# EAGLE design BEP21 555breakout (EAGLE 6.5.0)
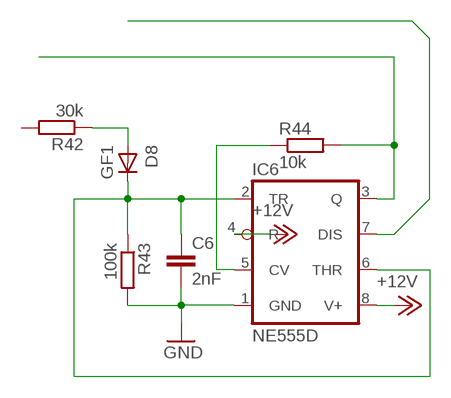
[diagram p0: schematic, sheet 1]

## Parts
C6  2nF  C-EUC1206K  [C1206K]
D8  GF1  [SMA-DO214AC]
IC6  NE555D  [SO08]
R42  30k  R-EU_R0805  [R0805]
R43  100k  R-EU_R0805  [R0805]
R44  10k  R-EU_R0805  [R0805]

## Nets
+12V: IC6.4(R) IC6.8(V+)
GND: C6.2 IC6.1(GND) R43.2
N$1: IC6.7(DIS)
N$84: D8.A R42.1
N$85: IC6.3(Q) R44.2
N$86: IC6.5(CV) R44.1
N$90: C6.1 D8.K(C) IC6.2(TR) IC6.6(THR) R43.1
Unconnected: R42.2

## Library data of the parts
C6 = rcl:C-EU: CAPACITOR, European symbol
D8 = diode:GF1: DIODE
IC6 = linear:*555: TIMER
R42-R44 = rcl:R-EU_: RESISTOR, European symbol

## Board
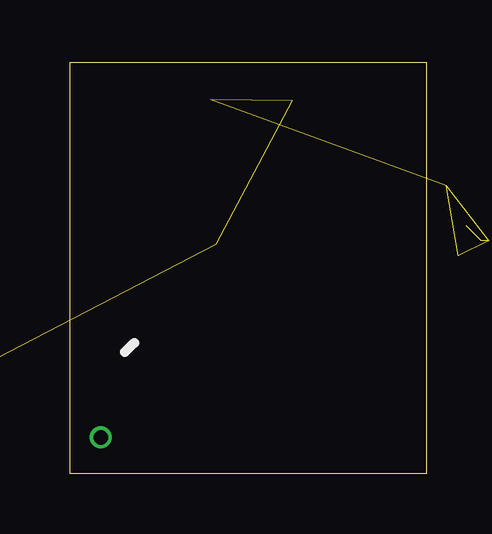
[diagram p1: board, top side]
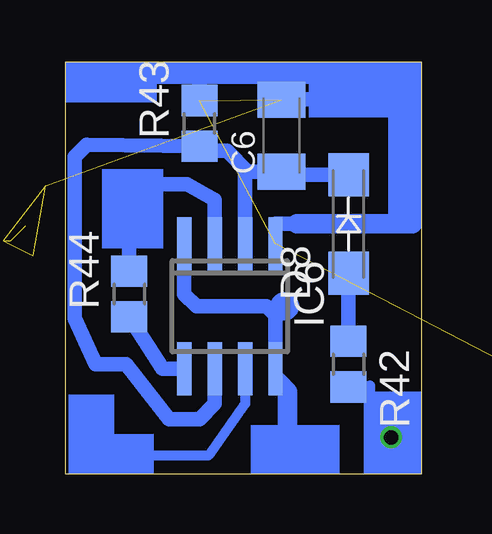
[diagram p2: board, bottom side, seen from below]

Size 14.86 x 17.14 mm. Coordinates in mm from the lower left corner, seen from the top.
Outline: 0,17.14 14.86,17.14 14.86,0 0,0 0,17.14
Copper layers (1*16): Top 0.035mm / dielectric 1.5mm / Bottom 0.035mm
Design rules "multi-cb_035um-cu *": minimum track width 6mil, minimum drill 12mil, track to track 16mil, track to pad 20mil, pad to pad 16mil, via to via 16mil, smd to smd 16mil, copper to edge 20mil, drill to drill 8mil, minimum pad ring 8mil, minimum via ring 6mil, stop-mask expansion 3mil, vias tented up to drill 0mil, thermal gap 8mil

### Footprints (pad centres in the part's own frame; a part is rotated, then mirrored left to right if it is on the bottom)
C1206K = smd 1.5 x 2: 1 -1.5,0; 2 1.5,0
SMA-DO214AC = smd 1.8 x 1.7: A -2.05,0; K 2.05,0
SO08 = smd 0.6 x 2.2: 1 -1.905,-2.6; 2 -0.635,-2.6; 3 0.635,-2.6; 4 1.905,-2.6; 5 1.905,2.6; 6 0.635,2.6; 7 -0.635,2.6; 8 -1.905,2.6
R0805 = smd 1.3 x 1.5: 1 -0.95,0; 2 0.95,0

### Placement (x,y rotation side)
C6  5.84,14.1 90 bottom
D8  3.05,10.41 90 bottom
IC6  8,6.98 180 bottom
R42  3.05,4.57 270 bottom
R43  9.27,14.6 90 bottom
R44  12.19,7.49 90 bottom

### Tracks (layer width: path | path; a pad name or v marks a point on that pad's centre or on a via)
+12V
  Bottom 0.61: IC6.4 9.91,7.49 9.4,6.98 6.48,6.98 6.1,6.6 IC6.8
GND  (12 unrouted)
N$1
  Bottom 0.406: IC6.7 7.37,2.92 8.89,0.76 11.3,0.76
N$2
  Bottom 0.406: 6.1,9.65 6.1,10.41
  Bottom 0.61: 6.1,10.41 5.21,10.41
  Bottom 0.813: 5.21,10.41 0.38,10.41
N$3
  Bottom 0.61: 9.27,15.49 9.27,16.64
N$4
  Bottom 0.813: 5.97,3.81 5.59,3.43 5.59,1.65
N$5  (via drill 0.6 pad 0.61)
  other vias: 1.27,1.52
N$6
  Bottom 0.406: 2.92,3.68 2.16,3.68 2.16,3.17
N$7
  Bottom 0.61: 5.59,15.62 4.32,15.62
N$74
  pour Bottom: 11.56,1.65 12.95,3.05 13.59,3.05 13.59,0.63 11.43,0.63 11.43,1.52
N$84
  Bottom 0.61: R42.1 D8.A
N$85
  Bottom 0.61: IC6.3 8.64,11.43 9.78,12.06 12.19,12.06 R44.2
N$86
  Bottom 0.61: R44.1 10.8,4.38 IC6.5
N$90
  Bottom 0.61: 2.81,12.46 D8.K 5.84,12.46 C6.1 | IC6.6 8.64,2.92 9.27,2.29 10.54,2.29 12.32,4.57 13.59,4.57 14.48,6.48 14.48,13.21 13.97,13.72 R43.1 9.08,13.46 8.13,13.46 7.26,12.6 C6.1 | C6.1 7.22,12.6 7.37,12.45 IC6.2
(copper drawn outside any net)
  shapes: Bottom area x10, Bottom circle x1